# EAGLE design programcounter (EAGLE 9.6.2)
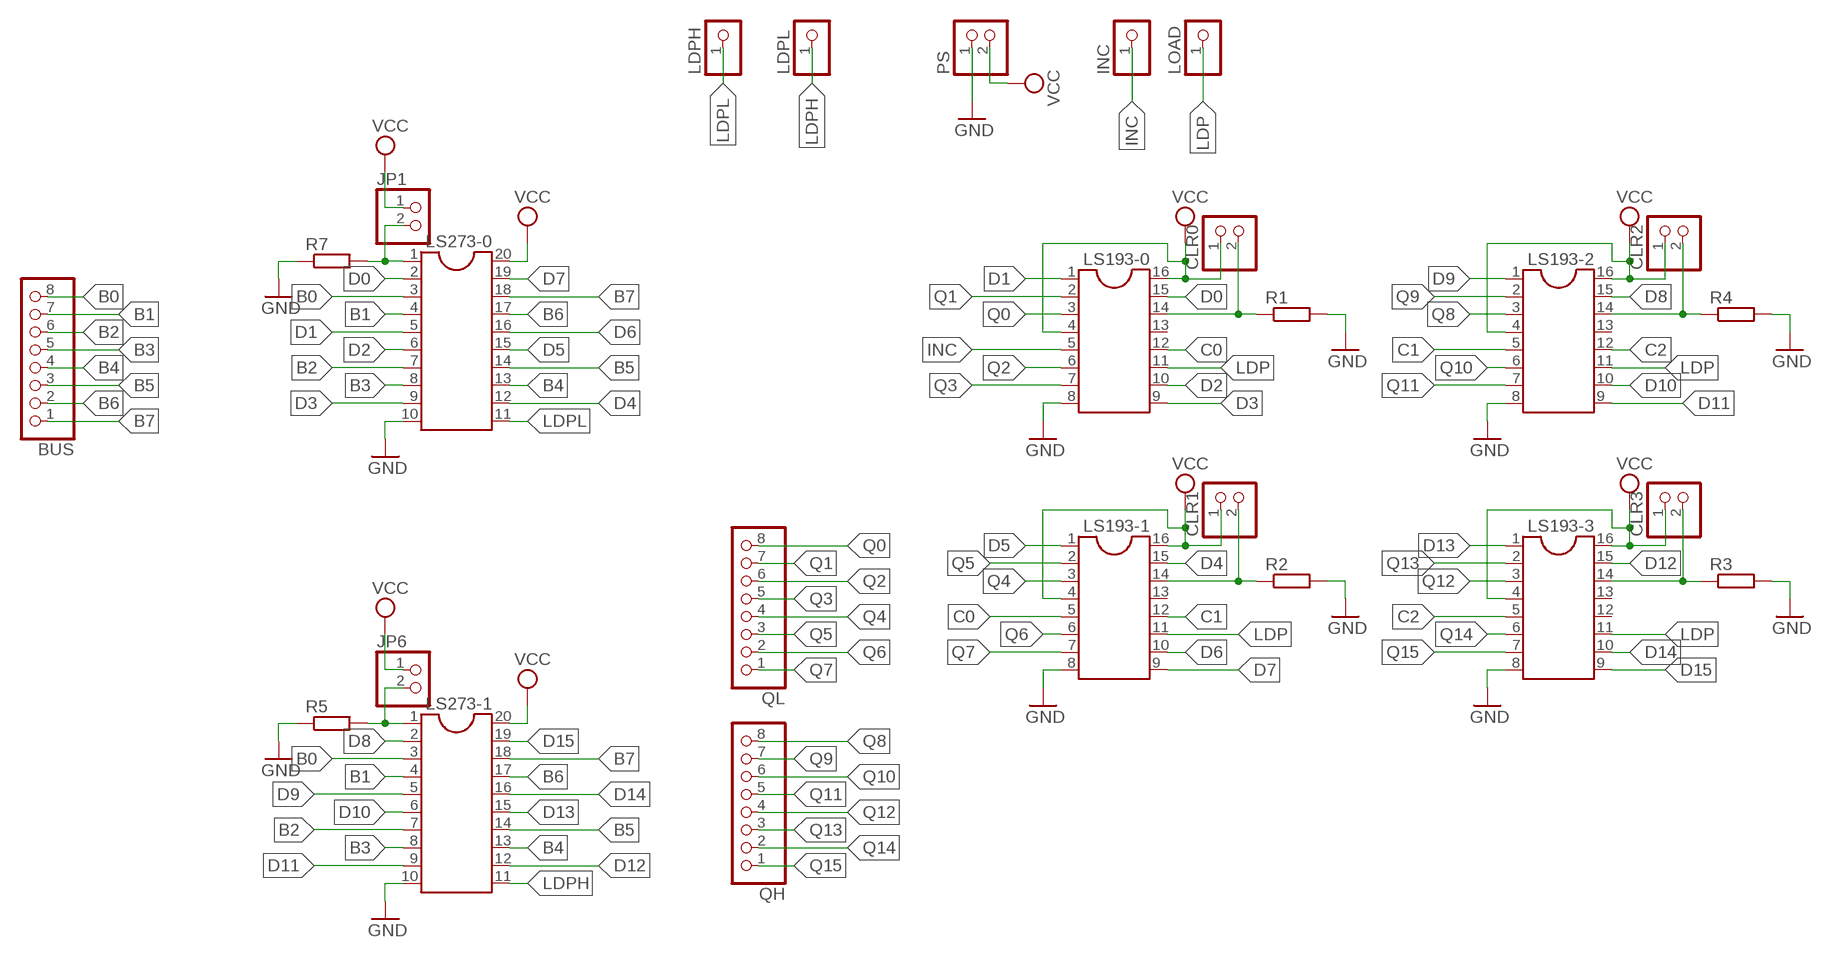
[diagram p0: schematic, sheet 1]

## Parts
BUS  PINHD-1X8  [1X08]
CLR0  PINHD-1X2  [1X02]
CLR1  PINHD-1X2  [1X02]
CLR2  PINHD-1X2  [1X02]
CLR3  PINHD-1X2  [1X02]
INC  PINHD-1X1  [1X01]
JP1  PINHD-1X2  [1X02]
JP6  PINHD-1X2  [1X02]
LDPH  PINHD-1X1  [1X01]
LDPL  PINHD-1X1  [1X01]
LOAD  PINHD-1X1  [1X01]
LS193-0  DIL16S  [SOCKET-16]
LS193-1  DIL16S  [SOCKET-16]
LS193-2  DIL16S  [SOCKET-16]
LS193-3  DIL16S  [SOCKET-16]
LS273-0  DIL20S  [SOCKET-20]
LS273-1  DIL20S  [SOCKET-20]
PS  PINHD-1X2  [1X02]
QH  PINHD-1X8  [1X08]
QL  PINHD-1X8  [1X08]
R1  R-EU_0204/7  [0204/7]
R2  R-EU_0204/7  [0204/7]
R3  R-EU_0204/7  [0204/7]
R4  R-EU_0204/7  [0204/7]
R5  R-EU_0204/7  [0204/7]
R7  R-EU_0204/7  [0204/7]

## Nets
B0: BUS.8 LS273-0.3 LS273-1.3
B1: BUS.7 LS273-0.4 LS273-1.4
B2: BUS.6 LS273-0.7 LS273-1.7
B3: BUS.5 LS273-0.8 LS273-1.8
B4: BUS.4 LS273-0.13 LS273-1.13
B5: BUS.3 LS273-0.14 LS273-1.14
B6: BUS.2 LS273-0.17 LS273-1.17
B7: BUS.1 LS273-0.18 LS273-1.18
C0: LS193-0.12 LS193-1.5
C1: LS193-1.12 LS193-2.5
C2: LS193-2.12 LS193-3.5
D0: LS193-0.15 LS273-0.2
D1: LS193-0.1 LS273-0.5
D2: LS193-0.10 LS273-0.6
D3: LS193-0.9 LS273-0.9
D4: LS193-1.15 LS273-0.12
D5: LS193-1.1 LS273-0.15
D6: LS193-1.10 LS273-0.16
D7: LS193-1.9 LS273-0.19
D8: LS193-2.15 LS273-1.2
D9: LS193-2.1 LS273-1.5
D10: LS193-2.10 LS273-1.6
D11: LS193-2.9 LS273-1.9
D12: LS193-3.15 LS273-1.12
D13: LS193-3.1 LS273-1.15
D14: LS193-3.10 LS273-1.16
D15: LS193-3.9 LS273-1.19
GND: LS193-0.8 LS193-1.8 LS193-2.8 LS193-3.8 LS273-0.10 LS273-1.10 PS.1 R1.2 R2.2 R3.2 R4.2 R5.1 R7.1
INC: INC.1 LS193-0.5
LDP: LOAD.1 LS193-0.11 LS193-1.11 LS193-2.11 LS193-3.11
LDPH: LDPL.1 LS273-1.11
LDPL: LDPH.1 LS273-0.11
N$1: CLR0.2 LS193-0.14 R1.1
N$2: JP1.2 LS273-0.1 R7.2
N$3: CLR2.2 LS193-2.14 R4.1
N$5: CLR3.2 LS193-3.14 R3.1
N$8: CLR1.2 LS193-1.14 R2.1
N$9: JP6.2 LS273-1.1 R5.2
Q0: LS193-0.3 QL.8
Q1: LS193-0.2 QL.7
Q2: LS193-0.6 QL.6
Q3: LS193-0.7 QL.5
Q4: LS193-1.3 QL.4
Q5: LS193-1.2 QL.3
Q6: LS193-1.6 QL.2
Q7: LS193-1.7 QL.1
Q8: LS193-2.3 QH.8
Q9: LS193-2.2 QH.7
Q10: LS193-2.6 QH.6
Q11: LS193-2.7 QH.5
Q12: LS193-3.3 QH.4
Q13: LS193-3.2 QH.3
Q14: LS193-3.6 QH.2
Q15: LS193-3.7 QH.1
VCC: CLR0.1 CLR1.1 CLR2.1 CLR3.1 JP1.1 JP6.1 LS193-0.4 LS193-0.16 LS193-1.4 LS193-1.16 LS193-2.4 LS193-2.16 LS193-3.4 LS193-3.16 LS273-0.20 LS273-1.20 PS.2
Unconnected: LS193-0.13 LS193-1.13 LS193-2.13 LS193-3.12 LS193-3.13

## Library data of the parts
BUS QH QL = pinhead:PINHD-1X8: PIN HEADER
CLR0 CLR1-CLR3 JP1 JP6 PS = pinhead:PINHD-1X2: PIN HEADER
INC LDPH LDPL LOAD = pinhead:PINHD-1X1: PIN HEADER
LS193-0 LS193-1-LS193-3 = ic-package:DIL16: Dual In Line / Socket
LS273-0 LS273-1 = ic-package:DIL20: Dual In Line / Socket
R1-R5 R7 = rcl:R-EU_: RESISTOR, European symbol; SPICEPREFIX: R

## Board
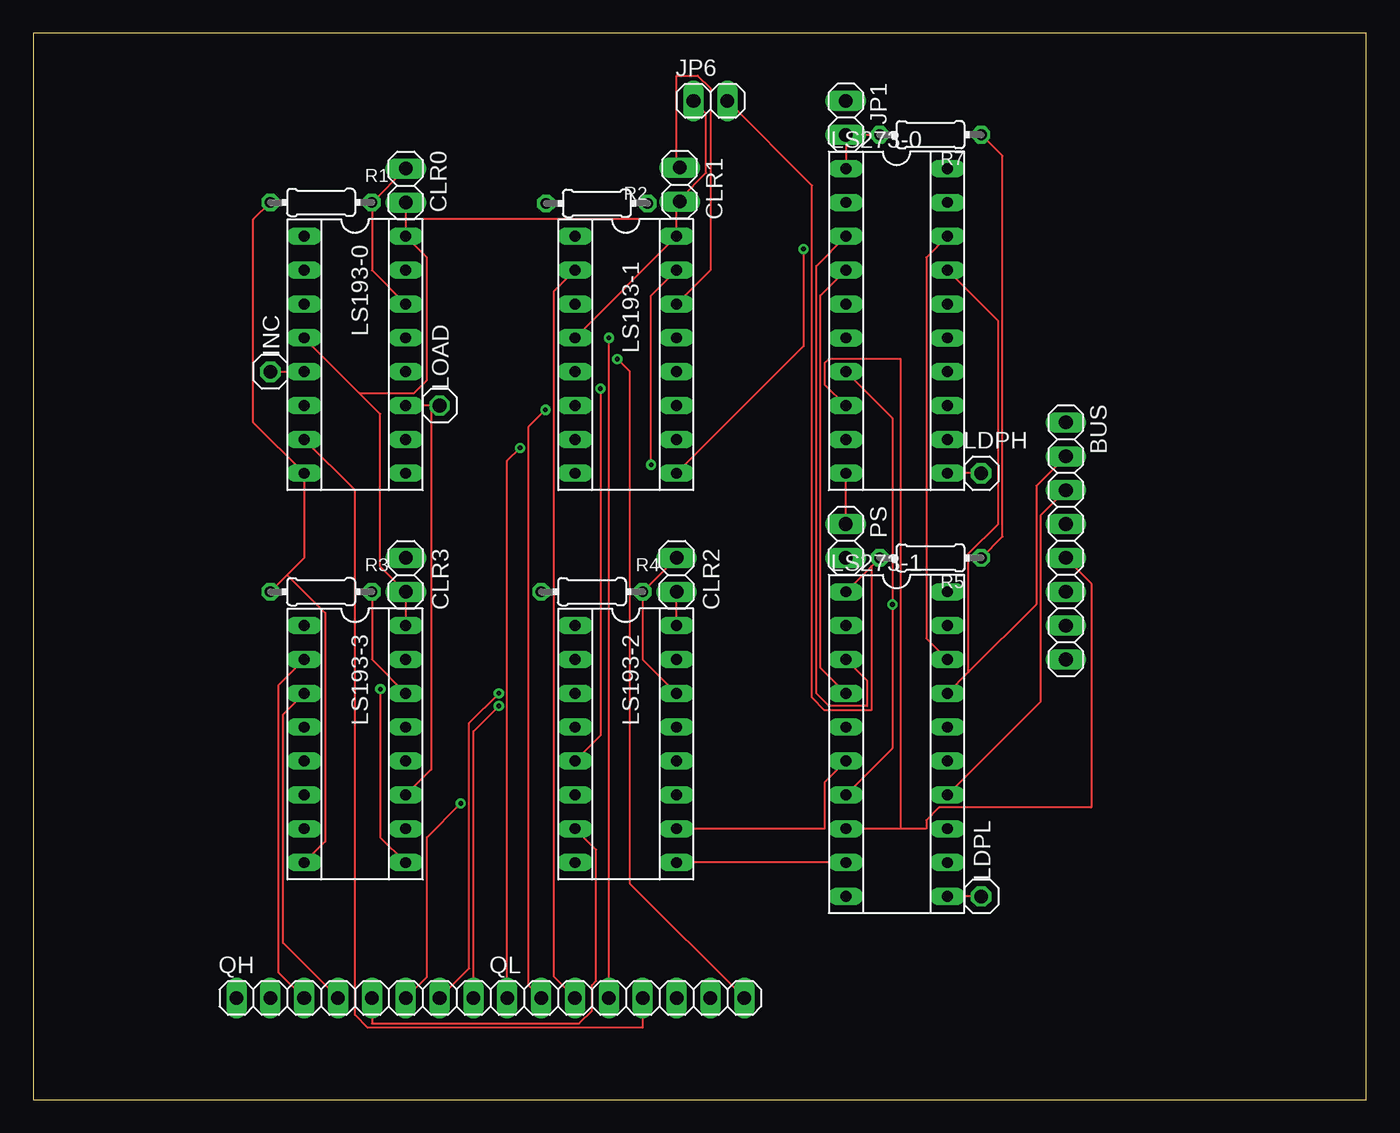
[diagram p1: board, top side]
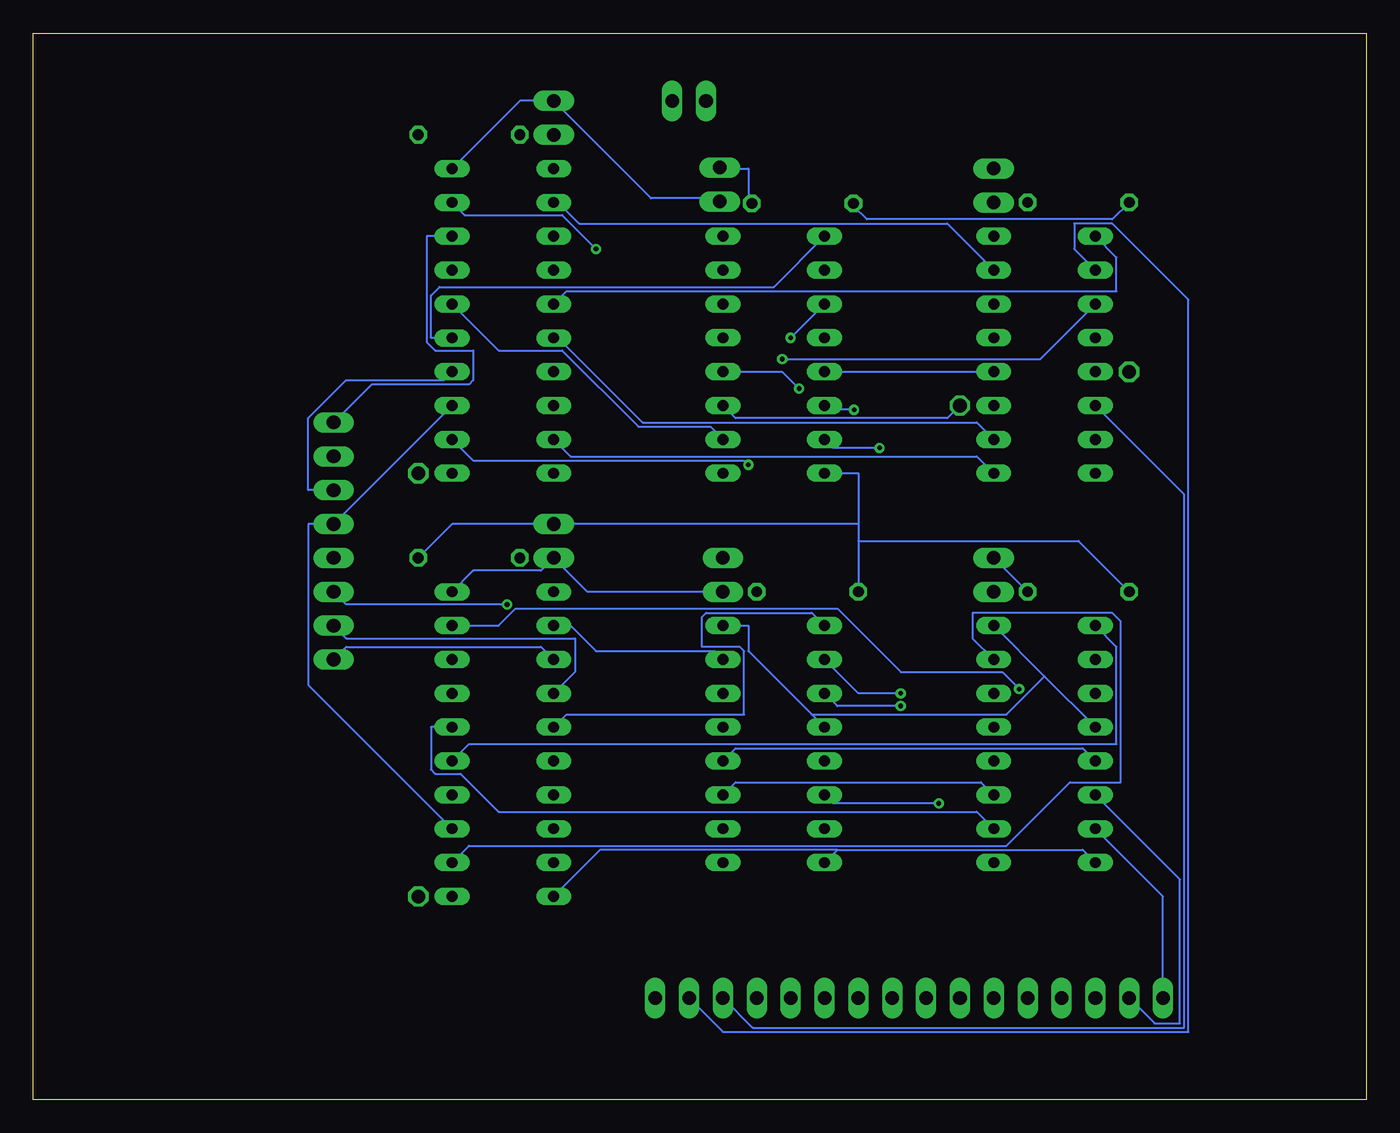
[diagram p2: board, bottom side, seen from below]

Size 100 x 80 mm. Coordinates in mm from the lower left corner, seen from the top.
Outline: 0,0 100,0 100,80 0,80 0,0
Copper layers (1*16): Top 0.035mm / dielectric 1.5mm / Bottom 0.035mm
Design rules "default": minimum track width 6mil, minimum drill 0.35mm, track to track 6mil, track to pad 6mil, pad to pad 6mil, via to via 6mil, smd to smd 6mil, copper to edge 40mil, drill to drill 6mil, minimum pad ring 10mil, minimum via ring 8mil, stop-mask expansion 4mil, vias tented up to drill 0mil, thermal gap 10mil

### Footprints (pad centres in the part's own frame; a part is rotated, then mirrored left to right if it is on the bottom)
1X08 = drill 1.016 long: 1 -8.89,0; 2 -6.35,0; 3 -3.81,0; 4 -1.27,0; 5 1.27,0; 6 3.81,0; 7 6.35,0; 8 8.89,0
1X02 = drill 1.016 long: 1 -1.27,0; 2 1.27,0
1X01 = drill 1.016 octagon: 1 0,0
SOCKET-16 = drill 0.813 long: 1 -8.89,-3.81; 2 -6.35,-3.81; 3 -3.81,-3.81; 4 -1.27,-3.81; 5 1.27,-3.81; 6 3.81,-3.81; 7 6.35,-3.81; 8 8.89,-3.81; 9 8.89,3.81; 10 6.35,3.81; 11 3.81,3.81; 12 1.27,3.81; 13 -1.27,3.81; 14 -3.81,3.81; 15 -6.35,3.81; 16 -8.89,3.81
SOCKET-20 = drill 0.813 long: 1 -11.43,-3.81; 2 -8.89,-3.81; 3 -6.35,-3.81; 4 -3.81,-3.81; 5 -1.27,-3.81; 6 1.27,-3.81; 7 3.81,-3.81; 8 6.35,-3.81; 9 8.89,-3.81; 10 11.43,-3.81; 11 11.43,3.81; 12 8.89,3.81; 13 6.35,3.81; 14 3.81,3.81; 15 1.27,3.81; 16 -1.27,3.81; 17 -3.81,3.81; 18 -6.35,3.81; 19 -8.89,3.81; 20 -11.43,3.81
0204/7 = drill 0.813 octagon: 1 -3.81,0; 2 3.81,0

### Placement (x,y rotation side)
BUS  77.47,41.91 270 top
CLR0  27.94,68.58 90 top
CLR1  48.49,68.65 90 top
CLR2  48.26,39.37 90 top
CLR3  27.94,39.37 90 top
INC  17.78,54.61 0 top
JP1  60.96,73.66 270 top
JP6  50.8,74.93 0 top
LDPH  71.12,46.99 0 top
LDPL  71.12,15.24 0 top
LOAD  30.48,52.07 0 top
LS193-0  24.13,55.88 270 top
LS193-1  44.45,55.88 270 top
LS193-2  44.45,26.67 270 top
LS193-3  24.13,26.67 270 top
LS273-0  64.77,58.42 270 top
LS273-1  64.77,26.67 270 top
PS  60.96,41.91 270 top
QH  24.13,7.62 0 top
QL  44.45,7.62 0 top
R1  21.59,67.31 180 top
R2  42.28,67.24 180 top
R3  21.59,38.1 180 top
R4  41.91,38.1 180 top
R5  67.31,40.64 180 top
R7  67.31,72.39 180 top

### Tracks (layer width: path | path; a pad name or v marks a point on that pad's centre or on a via)
B0
  Top 0.152: LS273-0.3 58.74,62.55 58.74,30.48 59.69,29.53 62.55,29.53 62.55,31.43 LS273-1.3
  Bottom 0.152: LS273-1.3 61.91,33.97 76.52,33.97 BUS.8
B1
  Top 0.152: LS273-0.4 59.05,60.33 59.05,32.38 LS273-1.4
  Bottom 0.152: LS273-1.4 59.37,32.07 59.37,34.61 76.52,34.61 BUS.7
B2  (via drill 0.35)
  Top 0.152: LS273-1.7 64.45,26.35 v64.45,37.15 64.45,51.12 LS273-0.7
  Bottom 0.152: BUS.6 76.52,37.15 v64.45,37.15
B3
  Top 0.152: 65.09,20.32 66.99,20.32 66.99,20.95 67.94,21.91 79.38,21.91 79.38,38.73 BUS.5 | 65.09,20.32 LS273-1.8 | LS273-0.8 59.37,53.66 59.37,55.24 59.69,55.56 65.09,55.56 65.09,20.32
B4
  Bottom 0.152: LS273-1.13 79.38,31.11 79.38,43.18 BUS.4 LS273-0.13
B5
  Top 0.152: LS273-1.14 75.56,29.84 75.56,43.81 BUS.3
  Bottom 0.152: LS273-0.14 69.22,53.98 76.52,53.98 79.38,51.12 79.38,45.72 BUS.3
B6
  Top 0.152: 70.17,32.07 75.25,37.15 75.25,46.04 BUS.2 | 70.17,32.07 LS273-1.17 | LS273-0.17 72.39,58.42 72.39,43.18 70.17,40.96 70.17,32.07
B7
  Top 0.152: LS273-1.18 66.99,34.61 66.99,63.18 LS273-0.18
  Bottom 0.152: BUS.1 74.61,53.66 67.31,53.66 66.99,53.98 66.99,56.2 69.85,56.2 70.48,56.83 70.48,64.77 LS273-0.18
C0
  Bottom 0.152: LS193-1.5 LS193-0.12
C1  (via drill 0.35)
  Top 0.152: LS193-2.5 42.55,27.3 v42.55,53.34
  Bottom 0.152: v42.55,53.34 43.81,54.61 LS193-1.12
C2
  Bottom 0.152: LS193-3.5 21.27,26.35 47.31,26.35 LS193-2.12
D0
  Bottom 0.152: LS193-0.15 31.43,65.72 59.05,65.72 60.64,67.31 LS273-0.2
D1
  Bottom 0.152: LS193-0.1 18.73,63.18 18.73,60.64 60.01,60.64 LS273-0.5
D2
  Bottom 0.152: LS193-0.10 29.21,50.8 54.29,50.8 60.64,57.15 LS273-0.6
D3
  Bottom 0.152: LS193-0.9 29.21,48.26 59.69,48.26 LS273-0.9
D4  (via drill 0.35)
  Top 0.152: LS193-1.15 46.35,60.33 v46.35,47.62
  Bottom 0.152: v46.35,47.62 46.67,47.94 66.99,47.94 LS273-0.12
D5
  Bottom 0.152: LS193-1.1 44.45,60.96 69.53,60.96 70.17,60.33 70.17,57.15 LS273-0.15
D6
  Bottom 0.152: LS193-1.10 49.21,50.48 54.61,50.48 60.33,56.2 65.09,56.2 LS273-0.16
D7  (via drill 0.35)
  Top 0.152: LS193-1.9 57.78,56.52 v57.78,63.82
  Bottom 0.152: v57.78,63.82 60.33,66.36 67.63,66.36 LS273-0.19
D8
  Bottom 0.152: LS193-2.15 48.9,33.66 57.78,33.66 59.69,35.56 LS273-1.2
D9
  Bottom 0.152: LS193-2.1 41.59,36.51 49.53,36.51 49.85,36.2 49.85,33.97 46.99,33.97 46.67,33.66 46.67,28.89 60.01,28.89 LS273-1.5
D10
  Top 0.152: LS193-2.10 59.37,20.32 59.37,23.81 LS273-1.6
D11
  Top 0.152: LS273-1.9 LS193-2.9
D12
  Bottom 0.152: LS193-3.15 29.53,34.61 29.53,36.51 19.05,36.51 18.41,35.88 18.41,23.81 22.23,23.81 26.99,19.05 67.31,19.05 LS273-1.12
D13
  Bottom 0.152: LS193-3.1 18.73,33.97 18.73,26.67 67.31,26.67 LS273-1.15
D14
  Bottom 0.152: LS193-3.10 29.21,21.59 65.09,21.59 67.94,24.45 69.85,24.45 70.17,24.77 70.17,27.94 LS273-1.16
D15  (via drill 0.35)
  Top 0.152: LS193-3.9 26.04,19.68 v26.04,30.8
  Bottom 0.152: v26.04,30.8 27.3,32.07 34.92,32.07 39.69,36.83 63.82,36.83 65.09,35.56 LS273-1.19
GND
  Top 0.152: PS.1 LS273-0.10 | R7.1 72.71,70.8 72.71,42.23 R5.1 | 19.05,39.37 20.32,40.64 LS193-0.8 16.51,50.8 16.51,66.04 R1.2 | 19.05,39.37 R3.2 | LS193-3.8 21.91,19.37 21.91,36.51 19.05,39.37
  Bottom 0.152: LS193-3.8 21.27,18.73 39.69,18.73 | LS193-2.8 39.69,18.73 | LS273-1.10 57.47,18.73 39.69,18.73 | R5.1 68.58,43.18 PS.1 38.1,43.18 | R1.2 19.05,66.04 37.47,66.04 38.42,66.99 R2.2 | 38.1,43.18 38.1,46.99 LS193-1.8 | 38.1,43.18 38.1,41.91 | 38.1,41.91 R4.2 | R3.2 21.59,41.91 38.1,41.91
INC
  Top 0.152: INC.1 LS193-0.5
LDP
  Top 0.152: 29.84,52.07 LS193-0.11 | LS193-3.11 29.84,24.77 29.84,52.07 | 29.84,52.07 LOAD.1
  Bottom 0.152: LS193-3.11 28.89,23.81 47.31,23.81 LS193-2.11 | LS193-1.11 47.31,51.12 31.43,51.12 LOAD.1
LDPH
  Top 0.152: LDPL.1 LS273-1.11
LDPL
  Top 0.152: LDPH.1 LS273-0.11
N$1
  Top 0.152: CLR0.2 R1.1 25.4,62.23 LS193-0.14
N$2
  Top 0.152: LS273-0.1 JP1.2 R7.2
N$3
  Top 0.152: CLR2.2 R4.1 45.72,33.02 LS193-2.14
N$5
  Top 0.152: LS193-3.14 25.4,33.02 R3.1
  Bottom 0.152: CLR3.2 R3.1
N$8
  Top 0.152: LS193-1.14 50.8,62.23 50.8,75.88 49.85,76.83 48.26,76.83 48.26,70.17 CLR1.2
  Bottom 0.152: R2.1 46.35,67.31 46.35,69.85 48.26,69.85 CLR1.2
N$9
  Top 0.152: R5.2 62.87,40.01 | 62.87,40.01 LS273-1.1 | JP6.2 58.42,68.58 58.42,30.16 59.37,29.21 62.87,29.21 62.87,40.01
Q0  (via drill 0.35)
  Top 0.152: v43.81,55.56 44.77,54.61 44.77,16.19 QL.8
  Bottom 0.152: LS193-0.3 24.45,55.56 v43.81,55.56
Q1
  Bottom 0.152: LS193-0.2 21.91,63.82 21.91,65.72 19.05,65.72 13.34,60.01 13.34,5.08 48.26,5.08 QL.7
Q2
  Bottom 0.152: LS193-0.6 13.65,45.4 13.65,5.4 46.04,5.4 QL.6
Q3
  Top 0.152: LS193-0.7 24.13,45.72 24.13,6.35 25.08,5.4 45.72,5.4 QL.5
Q4  (via drill 0.35)
  Top 0.152: QL.4 v43.18,57.15
  Bottom 0.152: v43.18,57.15 LS193-1.3
Q5
  Top 0.152: LS193-1.2 39.05,60.64 39.05,9.21 QL.3
Q6  (via drill 0.35)
  Top 0.152: v38.42,51.75 37.15,50.48 37.15,8.57 QL.2
  Bottom 0.152: LS193-1.6 40.32,51.75 v38.42,51.75
Q7  (via drill 0.35)
  Top 0.152: v36.51,48.9 35.56,47.94 QL.1
  Bottom 0.152: LS193-1.7 40.01,48.9 v36.51,48.9
Q8  (via drill 0.35)
  Top 0.152: v34.92,29.53 33.02,27.62 QH.8
  Bottom 0.152: LS193-2.3 39.69,29.53 v34.92,29.53
Q9  (via drill 0.35)
  Top 0.152: v34.92,30.48 32.7,28.26 32.7,9.84 QH.7
  Bottom 0.152: LS193-2.2 38.1,30.48 v34.92,30.48
Q10  (via drill 0.35)
  Top 0.152: v32.07,22.23 29.53,19.68 29.53,9.21 QH.6
  Bottom 0.152: LS193-2.6 40.01,22.23 v32.07,22.23
Q11
  Top 0.152: LS193-2.7 42.23,18.73 42.23,8.89 41.91,8.57 41.91,6.67 40.96,5.71 25.4,5.71 QH.5
Q12
  Top 0.152: LS193-3.3 18.73,28.89 18.73,11.75 QH.4
Q13
  Top 0.152: LS193-3.2 18.41,31.11 18.41,9.53 QH.3
Q14
  Bottom 0.152: LS193-3.6 13.97,16.51 13.97,5.71 15.88,5.71 QH.2
Q15
  Bottom 0.152: LS193-3.7 15.24,15.24 QH.1
VCC
  Top 0.152: CLR0.1 27.94,66.04 | 27.94,66.04 LS193-0.16 29.53,63.18 29.53,53.98 28.57,53.02 24.45,53.02 | LS193-1.4 LS193-1.16 48.26,66.04 | 48.26,66.04 48.26,67.31 CLR1.1 48.58,67.63 50.48,69.53 50.48,73.98 JP6.1 | 48.26,66.04 27.94,66.04 | 24.45,53.02 26.04,51.44 26.04,40.01 CLR3.1 LS193-3.16 | 24.45,53.02 LS193-0.4 | LS193-2.16 CLR2.1
  Bottom 0.152: LS273-0.20 63.5,74.93 JP1.1 53.66,67.63 48.58,67.63 CLR1.1 | LS193-3.16 24.13,31.75 | 24.13,31.75 LS193-3.4 | LS273-1.20 66.99,39.69 61.91,39.69 PS.2 58.42,38.1 CLR2.1 | 41.59,28.89 46.35,33.66 46.35,35.56 LS193-2.16 | 41.59,28.89 LS193-2.4 | 24.13,31.75 26.99,28.89 41.59,28.89